# Altium schematic sheet 3_BLE.SchDoc: SmartHalo - Radio
size B; Author: Sébastien Gélinas; Organization: SmartHalo; Address1: 5445 de Gaspé; Address2: Montréal, QC; Address3: Canada; Address4: H2T 3B2; DocumentNumber: 4; Revision: 1; SheetNumber: 3; SheetTotal: 8
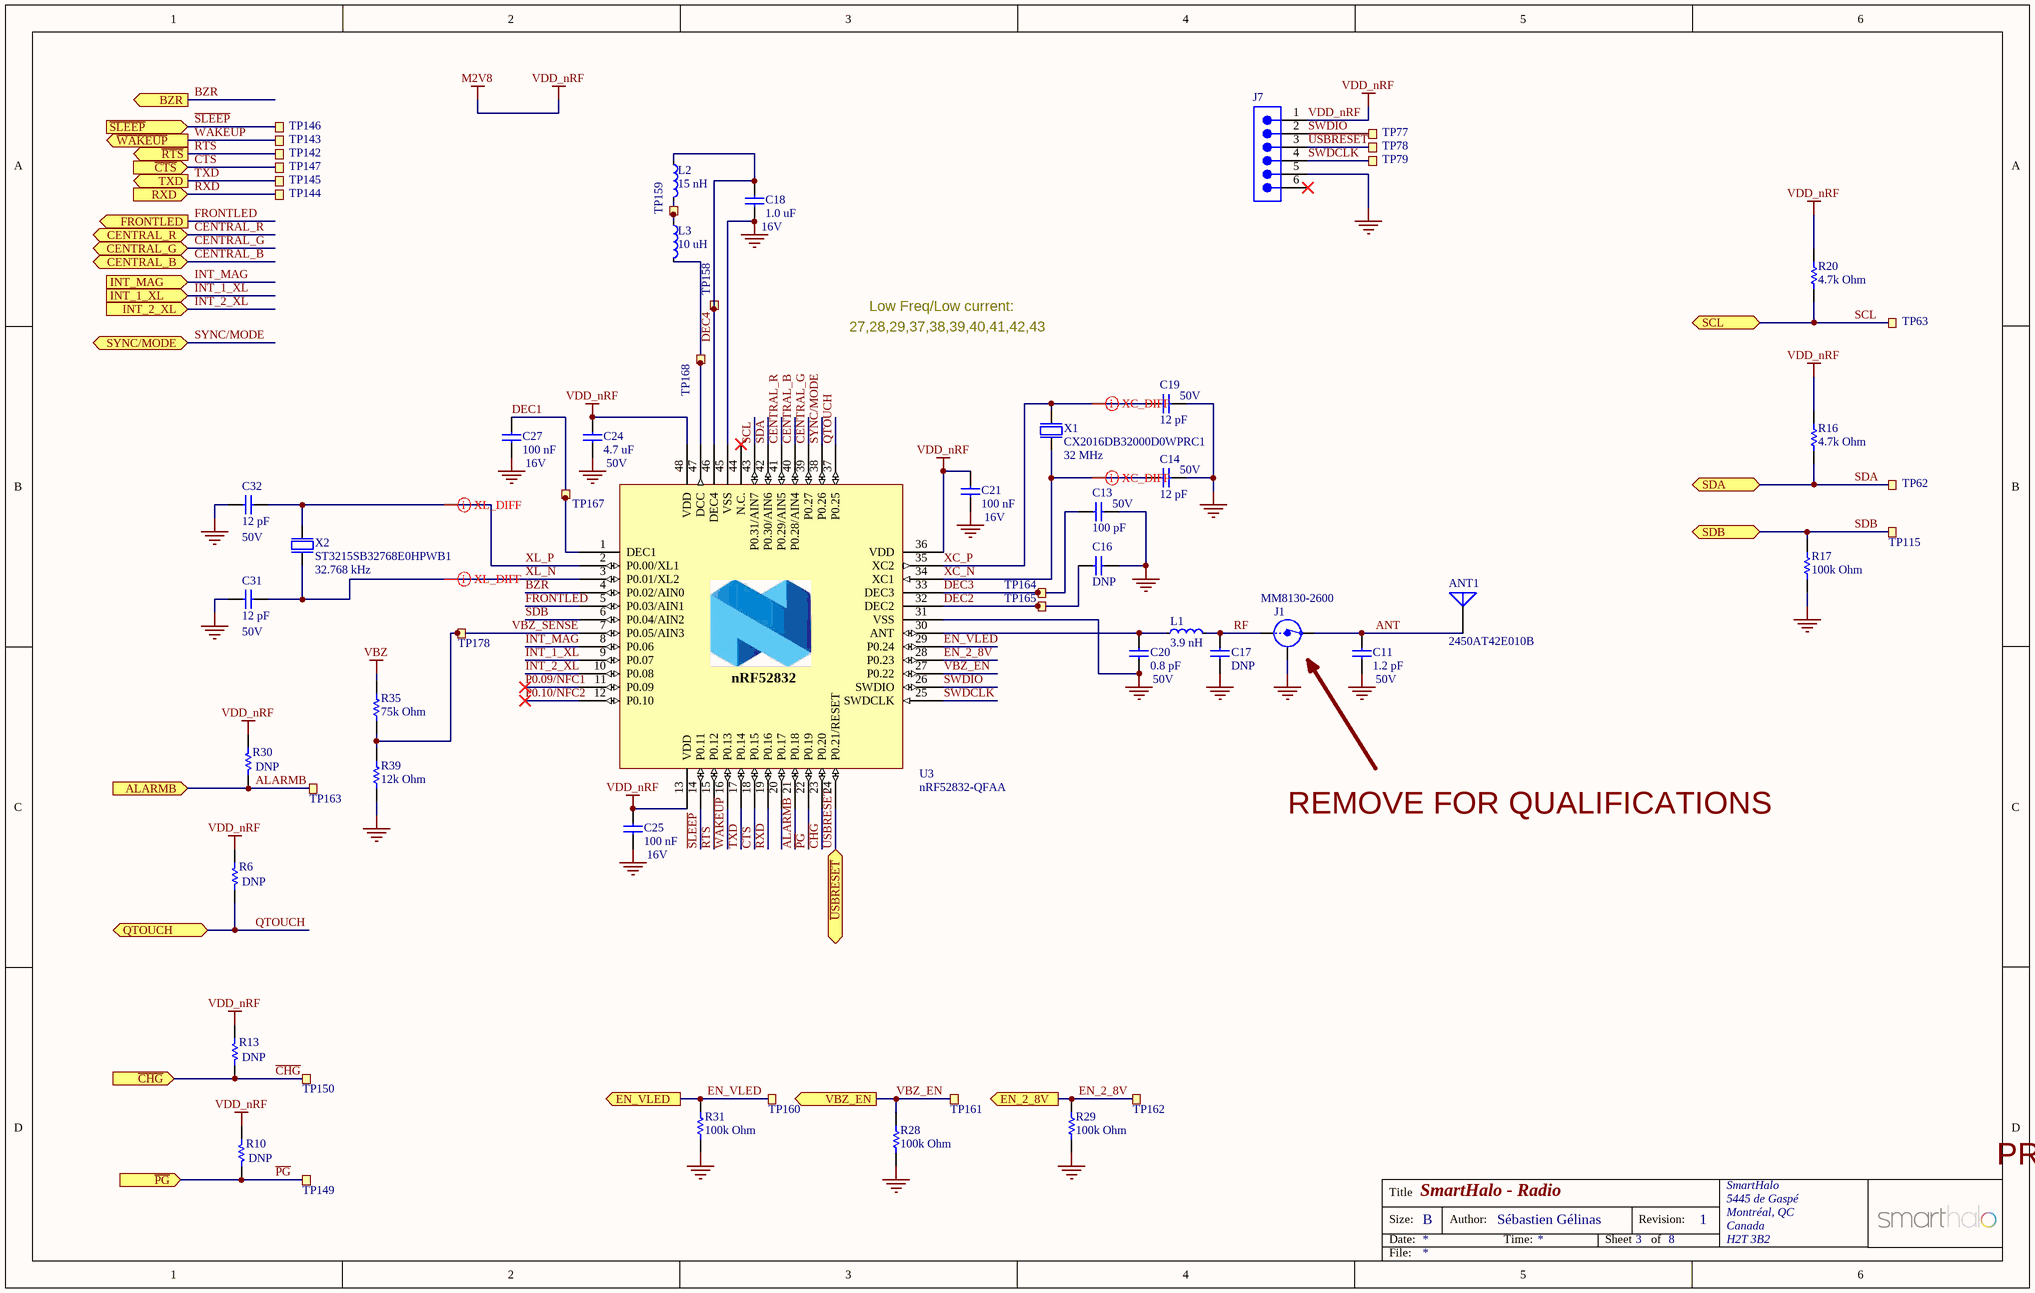
[diagram p0: 3_BLE.SchDoc]

## Parts
ANT1  2450AT42E010B  [2450AT42E010B]
C11  1.2 pF  Voltage Rating: 50V  [Varitron_CAP0402]
C13  100 pF  Voltage Rating: 50V  [Varitron_CAP0402]
C14  12 pF  Voltage Rating: 50V  [Varitron_CAP0402]
C16  DNP  [Varitron_CAP0402]  (no BOM)
C17  DNP  [Varitron_CAP0402]  (no BOM)
C18  1.0 uF  Voltage Rating: 16V  [Varitron_CAP0603]
C19  12 pF  Voltage Rating: 50V  [Varitron_CAP0402]
C20  0.8 pF  Voltage Rating: 50V  [Varitron_CAP0402]
C21  100 nF  Voltage Rating: 16V  [Varitron_CAP0402]
C24  4.7 uF  Voltage Rating: 50V  [Varitron_CAP0805]
C25  100 nF  Voltage Rating: 16V  [Varitron_CAP0402]
C27  100 nF  Voltage Rating: 16V  [Varitron_CAP0402]
C31  12 pF  Voltage Rating: 50V  [Varitron_CAP0402]
C32  12 pF  Voltage Rating: 50V  [Varitron_CAP0402]
J1  MM8130-2600  [COAXIAL-SWF]
J7  (no value)  [JLINK_6PIN_NEEDLE_ADAPTER]  (no BOM)
L1  3.9 nH  [Varitron_IND0402]
L2  15 nH  [Varitron_IND0402]
L3  10 uH  [Varitron_IND0603]
R6  DNP  [Varitron_RES0402]  (no BOM)
R10  DNP  [Varitron_RES0402]  (no BOM)
R13  DNP  [Varitron_RES0402]  (no BOM)
R16  4.7k Ohm  [Varitron_RES0402]
R17  100k Ohm  [Varitron_RES0402]
R20  4.7k Ohm  [Varitron_RES0402]
R28  100k Ohm  [Varitron_RES0402]
R29  100k Ohm  [Varitron_RES0402]
R30  DNP  [Varitron_RES0402]  (no BOM)
R31  100k Ohm  [Varitron_RES0402]
R35  75k Ohm  [Varitron_RES0402]
R39  12k Ohm  [Varitron_RES0402]
TP62  TP62  [TESTPAD-TH-35mils]  (value not drawn)  (no BOM)
TP63  TP63  [TESTPAD-TH-35mils]  (value not drawn)  (no BOM)
TP77  TP77  [TESTPAD-TH-35mils]  (value not drawn)  (no BOM)
TP78  TP78  [TESTPAD-TH-35mils]  (value not drawn)  (no BOM)
TP79  TP79  [TESTPAD-TH-35mils]  (value not drawn)  (no BOM)
TP115  TP115  [TESTPAD-TH-35mils]  (value not drawn)  (no BOM)
TP142  TP142  [TESTPAD-TH-35mils]  (value not drawn)  (no BOM)
TP143  TP143  [TESTPAD-TH-35mils]  (value not drawn)  (no BOM)
TP144  TP144  [TESTPAD-TH-35mils]  (value not drawn)  (no BOM)
TP145  TP145  [TESTPAD-TH-35mils]  (value not drawn)  (no BOM)
TP146  TP146  [TESTPAD-TH-35mils]  (value not drawn)  (no BOM)
TP147  TP147  [TESTPAD-TH-35mils]  (value not drawn)  (no BOM)
TP149  TP149  [TESTPAD-TH-35mils]  (value not drawn)  (no BOM)
TP150  TP150  [TESTPAD-TH-35mils]  (value not drawn)  (no BOM)
TP158  TP158  [TESTPAD-TH-35mils]  (value not drawn)  (no BOM)
TP159  TP159  [TESTPAD-TH-35mils]  (value not drawn)  (no BOM)
TP160  TP160  [TESTPAD-TH-35mils]  (value not drawn)  (no BOM)
TP161  TP161  [TESTPAD-TH-35mils]  (value not drawn)  (no BOM)
TP162  TP162  [TESTPAD-TH-35mils]  (value not drawn)  (no BOM)
TP163  TP163  [TESTPAD-TH-35mils]  (value not drawn)  (no BOM)
TP164  TP164  [TESTPAD-TH-35mils]  (value not drawn)  (no BOM)
TP165  TP165  [TESTPAD-TH-35mils]  (value not drawn)  (no BOM)
TP167  TP167  [TESTPAD-TH-35mils]  (value not drawn)  (no BOM)
TP168  TP168  [TESTPAD-TH-35mils]  (value not drawn)  (no BOM)
TP178  TP178  [TESTPAD-TH-35mils]  (value not drawn)  (no BOM)
U3  nRF52832-QFAA  [QFN40P600X600X90-48N]
X1  CX2016DB32000D0WPRC1  Frequency: 32 MHz  [CRYSTAL_2016_4Pins]
X2  ST3215SB32768E0HPWB1  Frequency: 32.768 kHz  [CRYSTAL_3215_2Pins]

## Ports
ALARMB (in), BZR (out), CENTRAL_B, CENTRAL_G, CENTRAL_R, EN_2_8V (out), EN_VLED (out), FRONTLED (out), INT_1_XL (in), INT_2_XL (in), INT_MAG (in), QTOUCH, RXD (in), SCL (bidir), SDA (bidir), SDB (bidir), SYNC/MODE, TXD (out), VBZ_EN (out), ~{CHG} (in), ~{CTS} (in), ~{PG} (in), ~{RTS} (out), ~{SLEEP} (in), ~{USBRESET}, ~{WAKEUP} (out)

## Nets
GND: ANT1.3(GND) ANT1.4(GND) C11.1 C13.2 C14.2 C16.2 C17.1 C18.2 C19.2 C20.1 C21.2 C24.2 C25.2 C27.2 C31.1 C32.1 J1.2(Shield) J7.5 R17.1 R28.2 R29.1 R31.1 R39.1 U3.31(VSS) U3.45(VSS) U3.49(GND) X1.2(GND) X1.4(GND)
VBZ: R35.2
VDD_nRF: C21.1 C24.1 C25.1 J7.1 R6.2 R10.2 R13.1 R16.2 R20.2 R30.2 U3.13(VDD) U3.36(VDD) U3.48(VDD)  [also labelled M2V8]
ALARMB: R30.1 TP163.1 U3.21(P0.18) ; port ALARMB
ANT: ANT1.1(Feed) C11.2 J1.3(OUT)
BZR: U3.4(P0.02/AIN0) ; port BZR
~{CHG}: R13.2 TP150.1 U3.23(P0.20) ; port ~{CHG}
CENTRAL_B: U3.40(P0.28/AIN4) ; port CENTRAL_B
CENTRAL_G: U3.39(P0.27) ; port CENTRAL_G
CENTRAL_R: U3.41(P0.29/AIN5) ; port CENTRAL_R
CTS: TP147.1 U3.18(P0.15) ; port ~{CTS}
DEC1: C27.1 TP167.1 U3.1(DEC1)
DEC2: C16.1 TP165.1 U3.32(DEC2)
DEC3: C13.1 TP164.1 U3.33(DEC3)
DEC4: C18.1 L2.1 TP158.1 U3.46(DEC4)
EN_2_8V: R29.2 TP162.1 U3.28(P0.23) ; port EN_2_8V
EN_VLED: R31.2 TP160.1 U3.29(P0.24) ; port EN_VLED
FRONTLED: U3.5(P0.03/AIN1) ; port FRONTLED
INT_1_XL: U3.9(P0.07) ; port INT_1_XL
INT_2_XL: U3.10(P0.08) ; port INT_2_XL
INT_MAG: U3.8(P0.06) ; port INT_MAG
P0.09/NFC1: U3.11(P0.09)
P0.10/NFC2: U3.12(P0.10)
~{PG}: R10.1 TP149.1 U3.22(P0.19) ; port ~{PG}
QTOUCH: R6.1 U3.37(P0.25) ; port QTOUCH
RF: C17.2 J1.1(IN) L1.2
RTS: TP142.1 U3.15(P0.12) ; port ~{RTS}
RXD: TP144.1 U3.19(P0.16) ; port RXD
~{SLEEP}: TP146.1 U3.14(P0.11) ; port ~{SLEEP}
SCL: R20.1 TP63.1 U3.43(P0.31/AIN7) ; port SCL
SDA: R16.1 TP62.1 U3.42(P0.30/AIN6) ; port SDA
SDB: R17.2 TP115.1 U3.6(P0.04/AIN2) ; port SDB
SWDCLK: J7.4 TP79.1 U3.25(SWDCLK)
SWDIO: J7.2 TP77.1 U3.26(SWDIO)
SYNC/MODE: U3.38(P0.26) ; port SYNC/MODE
TXD: TP145.1 U3.17(P0.14) ; port TXD
~{USBRESET}: J7.3 TP78.1 U3.24(P0.21/RESET) ; port ~{USBRESET}
VBZ_EN: R28.1 TP161.1 U3.27(P0.22) ; port VBZ_EN
VBZ_SENSE: R35.1 R39.2 TP178.1 U3.7(P0.05/AIN3)
~{WAKEUP}: TP143.1 U3.16(P0.13) ; port ~{WAKEUP}
XC_N: C14.1 U3.34(XC1) X1.3(out)
XC_P: C19.1 U3.35(XC2) X1.1(inp)
XL_N: C31.2 U3.3(P0.01/XL2) X2.2
XL_P: C32.2 U3.2(P0.00/XL1) X2.1
NetC20_2: C20.2 L1.1 U3.30(ANT)
NetL2_2: L2.2 L3.1 TP159.1
NetL3_2: L3.2 TP168.1 U3.47(DCC)

Not connected (* = marked no-connect by the designer): ANT1 2(NC); J7 6*; U3 20(P0.17) 44(N.C.)*

## Layout directives
differential pair: XC_N, XC_P, XL_N, XL_P

## Notes on the sheet
- 27,28,29,37,38,39,40,41,42,43
- Low Freq/Low current:
- REMOVE FOR QUALIFICATIONS
- PRELIMINARY: DO NOT USE FOR PRODUCTION
- Title
- Size:
- Date:
- B
- Author:
- Time:
- Sheet
- Revision:
- of
- File:
- (in symbol nRF52832_QFAA) nRF52832

## Library data of the parts
ANT1 = 2450AT42E010B: CHIP ANTENNA, 2.45GHz, 5 x 2 x 1.5 mm body; Manufacturer: Johanson Technology; SmartHalo Part Number: 630001-01; Final: N; Part Number: 2450AT42E010B; Manufacturer Part Number: 2450AT42E010B; Supplier: Arrow Electronics; Footprint Name: CUSTOM(2 pins)
C11 = Varitron_CAP0402: 1.2 pF 50V NP0 ±0.1 pF 0402 (1005 Metric)  SMD; Manufacturer: Samsung; Manufacturer Part Number: CL05C1R2BB5NNNC; SmartHalo Part Number: 630005-01; Case-EIA: 0402; Case-Metric: 1005; Tolerance: ±0.1 pF; Final: N; Technology: SMT; Temperature Coefficient: NP0; Part Number: CL05C1R2BB5NNNC; Value: 1.2 pF; Supplier: Arrow Electronics; Footprint Name: 0402
C13 = Varitron_CAP0402: 100 pF 50V NP0 5% 0402 (1005 Metric)  SMD; Manufacturer: Yageo; Manufacturer Part Number: CC0402JRNPO9BN101; SmartHalo Part Number: 630006-01; Case-EIA: 0402; Case-Metric: 1005; Final: N; Tolerance: 5%; Technology: SMT; Temperature Coefficient: NP0; Part Number: CC0402JRNPO9BN101; Value: 100 pF; Supplier: Arrow Electronics; Footprint Name: 0402
C14 C19 C31 C32 = Varitron_CAP0402: 12 pF 50V NP0 2% 0402 (1005 Metric)  SMD; Manufacturer: Yageo; Manufacturer Part Number: CC0402GRNPO9BN120; SmartHalo Part Number: 630007-01; Case-EIA: 0402; Case-Metric: 1005; Final: N; Tolerance: 2%; Technology: SMT; Temperature Coefficient: NP0; Part Number: CC0402GRNPO9BN120; Value: 12 pF; Supplier: Arrow Electronics; Footprint Name: 0402
C16 C17 = Varitron_CAP0402: C nF V TEMP TOL% 0402 (1005 Metric)  SMD; Case-EIA: 0402; Case-Metric: 1005; Tolerance: TOL; Value: C nF; Final: N; Technology: SMT; Supplier: Arrow Electronics; Footprint Name: 0402
C18 = Varitron_CAP0603: 1.0 uF 16V X7R 10% 0603 (1608 Metric)  SMD; Manufacturer: Samsung; Manufacturer Part Number: CL10B105KO8NNNC; SmartHalo Part Number: 630002-01; Case-EIA: 0603; Case-Metric: 1608; Final: N; Tolerance: 10%; Technology: SMT; Temperature Coefficient: X7R; Part Number: CL10B105KO8NNNC; Value: 1.0 uF; Supplier: Arrow Electronics; Footprint Name: 0603
C20 = Varitron_CAP0402: 0.8 pF 50V NP0 ±0.05pF 0402 (1005 Metric)  SMD; Manufacturer: Murata; Manufacturer Part Number: GRM1555C1HR80WA01D; SmartHalo Part Number: 630008-01; Case-EIA: 0402; Case-Metric: 1005; Final: N; Tolerance: ±0.05pF; Technology: SMT; Temperature Coefficient: NP0; Part Number: GRM1555C1HR80WA01D; Value: 0.8 pF; Supplier: Arrow Electronics; Footprint Name: 0402
C21 C25 C27 = Varitron_CAP0402: 100 nF 16V X7R 10% 0402 (1005 Metric)  SMD; Manufacturer: Samsung; Manufacturer Part Number: CL05B104KO5NNNC; SmartHalo Part Number: 630003-01; Case-EIA: 0402; Case-Metric: 1005; Final: N; Tolerance: 10%; Technology: SMT; Temperature Coefficient: X7R; Part Number: CL05B104KO5NNNC; Value: 100 nF; Supplier: Arrow Electronics; Footprint Name: 0402
C24 = Varitron_CAP0805: 4.7 uF 50V X5R 10% 0805 (2012 Metric)  SMD; Manufacturer: Samsung; Manufacturer Part Number: CL21A475KBQNNNE; SmartHalo Part Number: 630010-01; Case-EIA: 0805; Case-Metric: 2012; Final: N; Tolerance: 10%; Technology: SMT; Temperature Coefficient: X5R; Part Number: CL21A475KBQNNNE; Value: 4.7 uF; Supplier: Arrow Electronics; Footprint Name: 0805
J1 = Coaxial-Internal-SW: Coaxial Connector with Switch; Manufacturer: Murata; 2nd source part number: 81-MM8130-2600RA2; SmartHalo Part Number: 630019-01; Artikkelnr Noca: 55029011; Artikkelnr Simpro: N.A.; Final: N; Part Number: MM8130-2600; Manufacturer Part Number: MM8130-2600; Datasheet: http://www.murata.com/products/catalog/pdf/o33e.pdf; LatestRevisionDate: 2014-04-24; Pin Count: 3; Publisher: Nordic Semiconductor; Published: 2014-04-24; Note: *; Supplier: Digi-Key; Supplier part number: 490-4981-1-ND; 2nd source Supplier: Mouser; Footprint Doc: COAXIAL-SWF; Footprint Name: CUSTOM(6 pins)
J7 = JLINK_6PIN_NEEDLE_ADAPTER: JLink 6 Pin Needle Adapter for Flasher ARM Programmer; Manufacturer: JLink; Supplier: Digikey
L1 = Varitron_IND0402: 3.9 nH ±0.1 nH, 170 mA, 0402 (1005 Metric)  SMD; Manufacturer: Murata; Manufacturer Part Number: LQP15MN3N9B02D; SmartHalo Part Number: 630024-01; Case-EIA: 0402; Case-Metric: 1005; Tolerance: ±0.1 nH; SRF: MHz; DCR: Ohm; Final: N; Technology: SMT; Part Number: LQP15MN3N9B02D; Value: 3.9 nH; Supplier: Arrow Electronics; Footprint Name: 0402
L2 = Varitron_IND0402: 15 nH 5%, 320 mA, 0402 (1005 Metric)  SMD; Manufacturer: Murata; Manufacturer Part Number: LQG15HS15NJ02D; SmartHalo Part Number: 630025-01; Case-EIA: 0402; Case-Metric: 1005; SRF: MHz; DCR: 0.32 Ohm; Q: 8; Final: Y; Tolerance: 5%; Technology: SMT; Part Number: LQG15HS15NJ02D; Value: 15 nH; Supplier: Arrow Electronics; Footprint Name: 0402
L3 = Varitron_IND0603: 10 uH 20%, 400 mA, 0603 (1608 Metric)  SMD; Manufacturer: TDK Corporation; Manufacturer Part Number: GLFR1608T100M-LR; SmartHalo Part Number: 630026-01; Case-EIA: 0603; Case-Metric: 1608; SRF: MHz; DCR: 0.36 Ohm; Final: Y; Tolerance: 20%; Technology: SMT; Part Number: GLFR1608T100M-LR; Value: 10 uH; Supplier: Arrow Electronics; Footprint Name: 0603
R6 R30 = Varitron_RES0402: 100k 0.063W 5%  0402 (1005 Metric)  SMD; Manufacturer: Samsung; Manufacturer Part Number: RC1005J104CS; SmartHalo Part Number: 630036-01; Case-Metric: 1005; Case-EIA: 0402; Value: 100k Ohm; Final: N; Tolerance: 5%; Technology: SMT; Power: 0.063W; Part Number: RC1005J104CS; Footprint Name: 0402; Supplier: Arrow Electronics
R10 R13 = Varitron_RES0402: 10k 0.063W 5%  0402 (1005 Metric)  SMD; Manufacturer: Samsung; Manufacturer Part Number: RC1005J103CS; SmartHalo Part Number: 630041-01; Case-Metric: 1005; Case-EIA: 0402; Value: 10k Ohm; Final: N; Tolerance: 5%; Technology: SMT; Power: 0.063W; Part Number: RC1005J103CS; Footprint Name: 0402; Supplier: Arrow Electronics
R16 R20 = Varitron_RES0402: 4k7 0.063W 5%  0402 (1005 Metric)  SMD; Manufacturer: Samsung; Manufacturer Part Number: RC1005J472CS; SmartHalo Part Number: 630044-01; Case-Metric: 1005; Case-EIA: 0402; Final: N; Tolerance: 5%; Technology: SMT; Power: 0.063W; Part Number: RC1005J472CS; Value: 4.7k Ohm; Footprint Name: 0402; Supplier: Arrow Electronics
R17 R28 R29 R31 = Varitron_RES0402: 100k 0.063W 5%  0402 (1005 Metric)  SMD; Manufacturer: Samsung; Manufacturer Part Number: RC1005J104CS; SmartHalo Part Number: 630036-01; Case-Metric: 1005; Case-EIA: 0402; Final: N; Tolerance: 5%; Technology: SMT; Power: 0.063W; Part Number: RC1005J104CS; Value: 100k Ohm; Footprint Name: 0402; Supplier: Arrow Electronics
R35 = Varitron_RES0402: 75k 0.063W 5%  0402 (1005 Metric)  SMD; Manufacturer: Samsung; Manufacturer Part Number: RC1005J753CS; SmartHalo Part Number: 630048-01; Case-Metric: 1005; Case-EIA: 0402; Final: N; Tolerance: 5%; Technology: SMT; Power: 0.063W; Part Number: RC1005J753CS; Supplier: Arrow Electronics; Footprint Name: 0402; Value: 75k Ohm
R39 = Varitron_RES0402: 12k 0.063W 5%  0402 (1005 Metric)  SMD; Manufacturer: Samsung; Manufacturer Part Number: RC1005J123CS; SmartHalo Part Number: 630047-01; Case-Metric: 1005; Case-EIA: 0402; Final: N; Tolerance: 5%; Technology: SMT; Power: 0.063W; Part Number: RC1005J123CS; Supplier: Arrow Electronics; Footprint Name: 0402; Value: 12k Ohm
TP62 TP63 TP77-TP79 TP115 TP142-TP147 TP149 TP150 TP158-TP165 TP167 TP168 TP178 = TESTPAD_TH_35mils: Testpoint, through hole, 35 mils; Value: TP
U3 = nRF52832_QFAA: Multi-protocol Bluetooth Low Energy and 2.4GHz proprietary system-on-chip; Manufacturer: Nordic Semiconductor; SmartHalo Part Number: 630053-01; Artikkelnr Noca: N.A.; Final: Y; Part Number: nRF52832-QFAA; Manufacturer Part Number: nRF52832-QFAA; Datasheet: *; LatestRevisionDate: 2014-11-26; Pin Count: 48; Publisher: Nordic Semiconductor; Published: 2014-11-26; Note: *; Supplier: Arrow Electronics; Supplier Part Number: *; 2nd source Supplier: *; 2nd source part number: *; Footprint Doc: QFN-48; Artikkelnr Simpro: N.A.; Footprint Name: QFN48TP
X1 = CX2016DB32000D0WPRC1: XTAL 32 MHz, 8pF, 3.2 x 1.5 mm, ±20 ppm Tol, ±200 ppm Drift; Manufacturer: AVX/Kyocera; SmartHalo Part Number: 630066-01; Frequency Drift: ±40 ppm; Final: Y; Manufacturer Part Number: CX2016DB32000D0WPRC1; Part Number: CX2016DB32000D0WPRC1; Frequency Tolerance: ±40 ppm; Load Capacitance: 8 pF; Supplier: Arrow Electronics; Footprint Name: XTAL2016
X2 = ST3215SB32768E0HPWB1: XTAL 32.768 kHz, 9pF, 3.2 x 1.5 mm, ±20 ppm Tol, ±200 ppm Drift; Manufacturer: AVX/Kyocera; SmartHalo Part Number: 630067-01; Frequency Tolerance: ±20 ppm; Frequency Drift: ±200 ppm; Final: Y; Manufacturer Part Number: ST3215SB32768E0HPWB1; Part Number: ST3215SB32768E0HPWB1; Load Capacitance: 9 pF; Footprint Name: XTAL3215; Supplier: Arrow Electronics